# Altium schematic sheet GSM_HTTP_Enabled.SCHDOC: Weather Station with webinterface
size C; Organization: Altium Limited; Address1: L3, 12a Rodborough Rd; Address2: Frenchs Forest; Address3: NSW; Address4: Australia 2086; DocumentNumber: 1; SheetNumber: 1; SheetTotal: 2
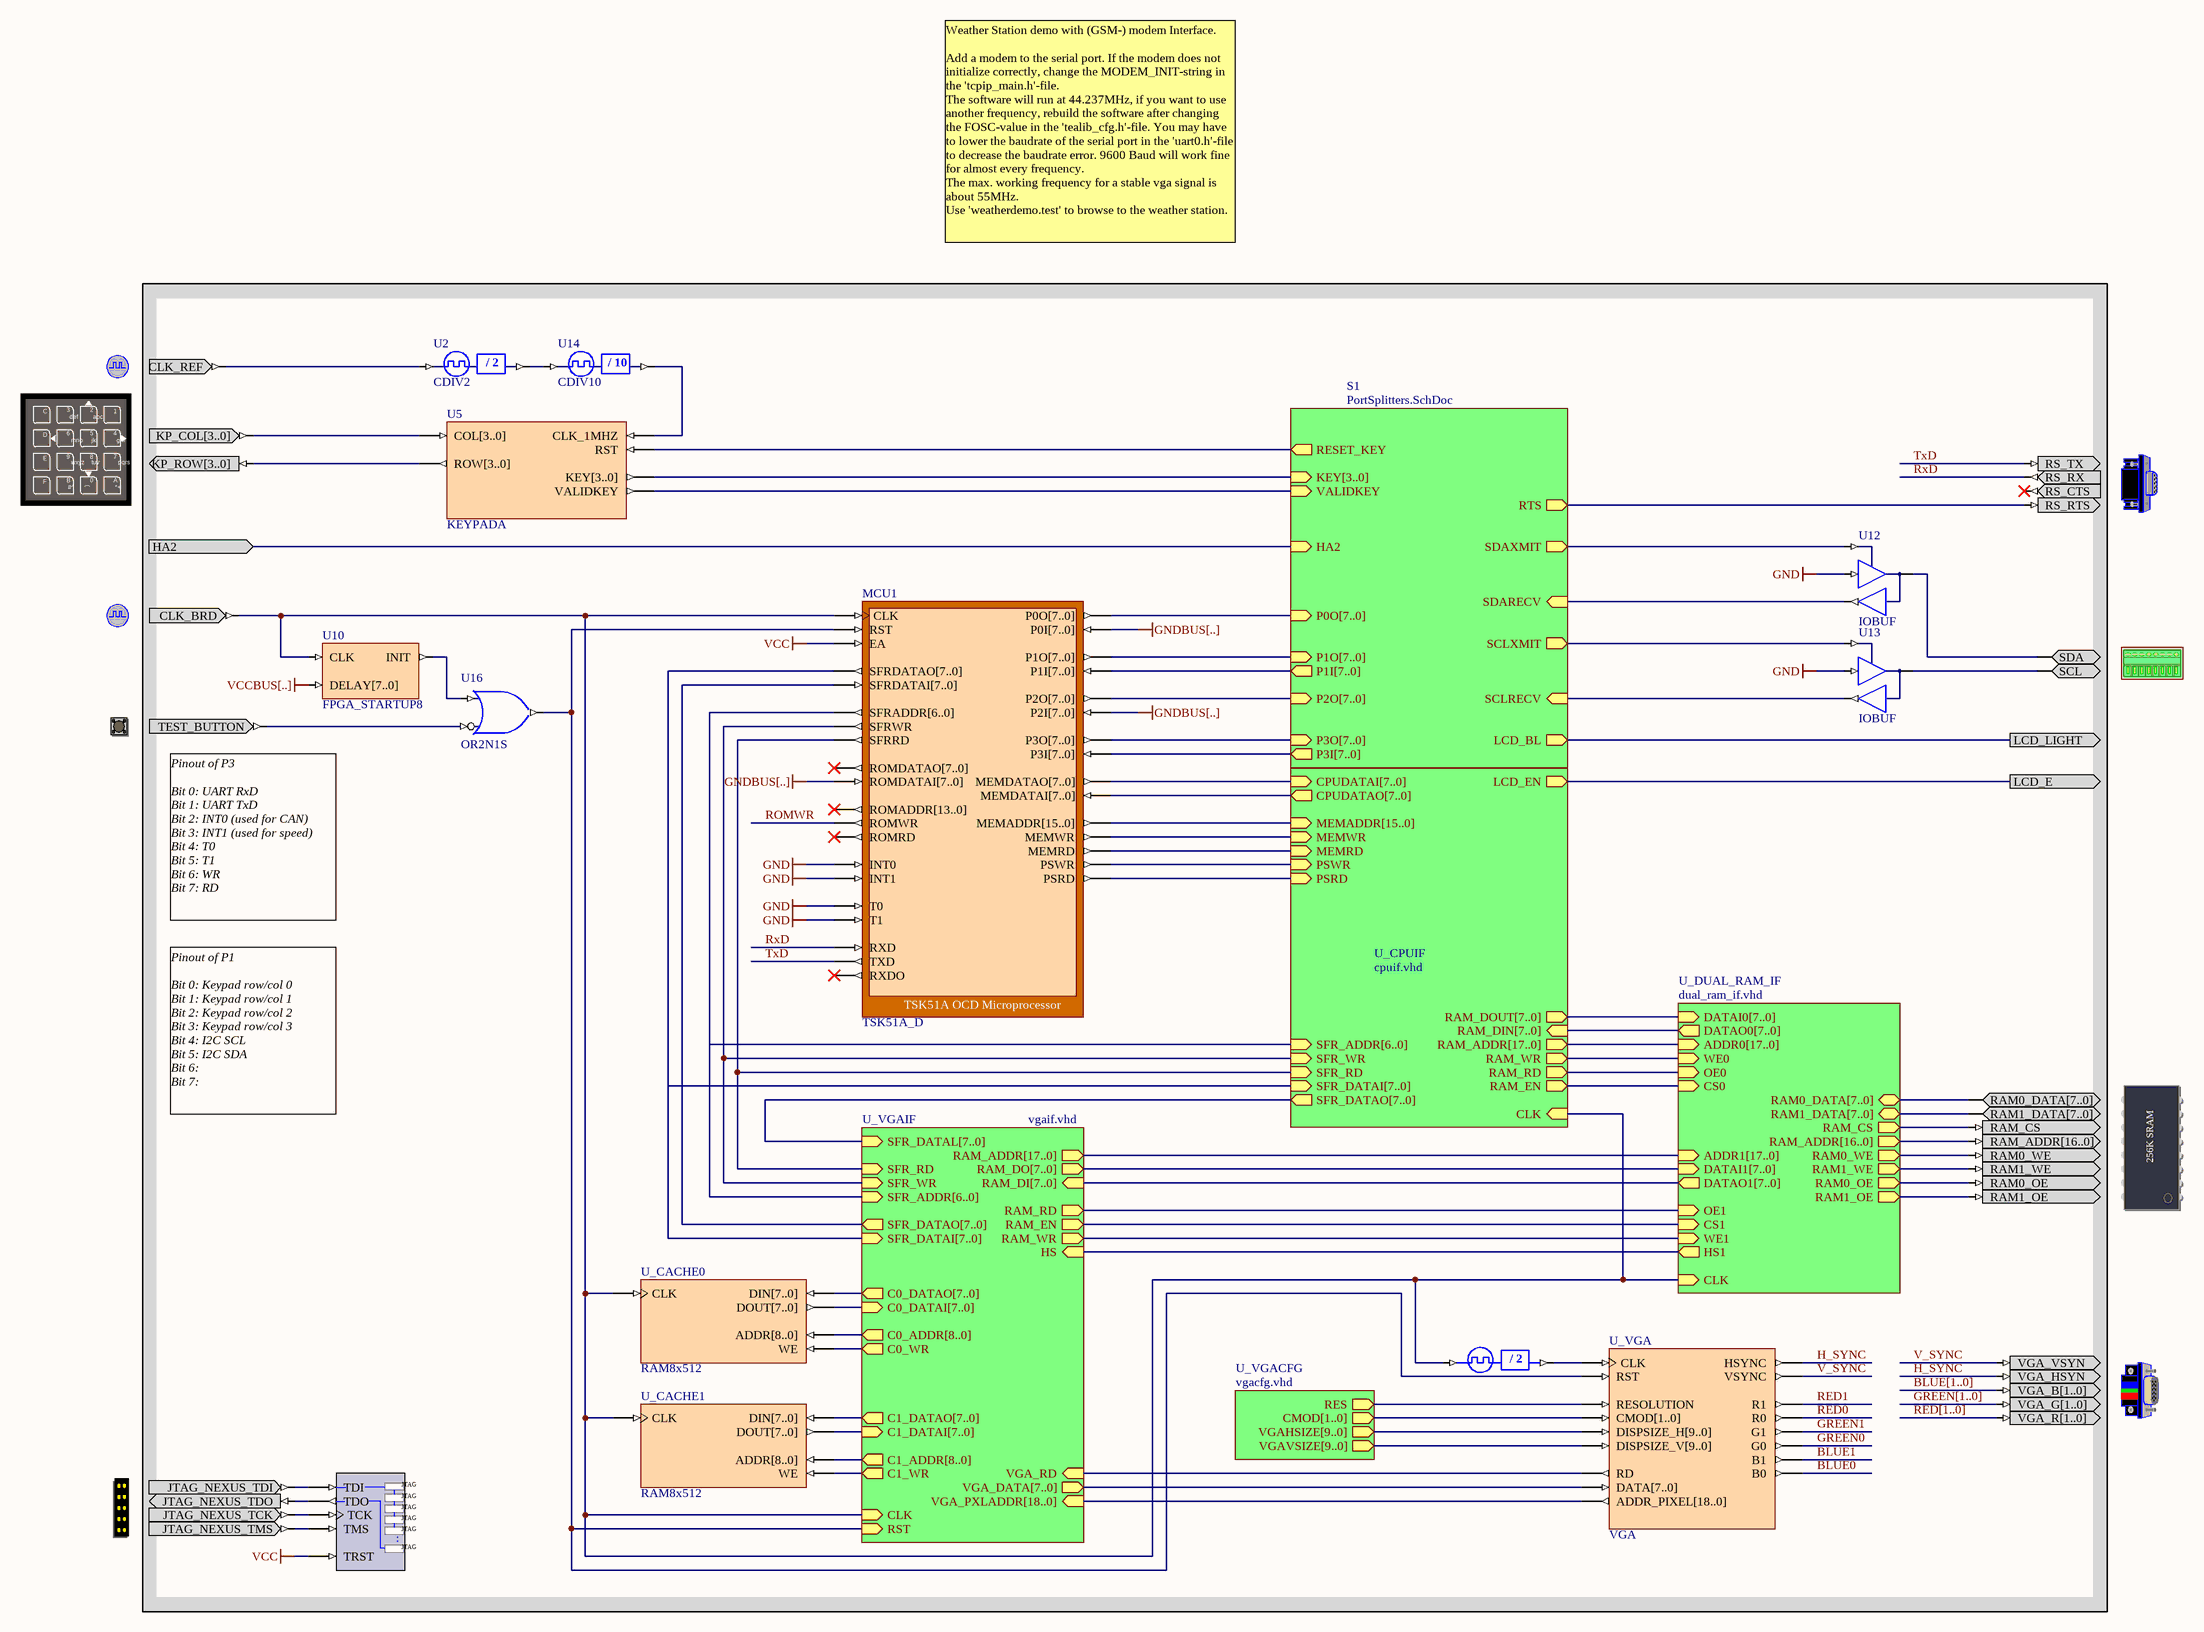
[diagram p0: GSM_HTTP_Enabled.SCHDOC]

## Parts
(Parts that share a designator on the sheet are numbered #1, #2 ... from top to bottom, then left to right.)
?#1  CLOCK_REFERENCE  (value not drawn)
?#2  KEYPAD  (value not drawn)
?#3  RS232CNTR  (value not drawn)
?#4  CLOCK_BOARD  (value not drawn)
?#5  ADCDAC_I2C  (value not drawn)
?#6  TEST_BUTTON  (value not drawn)
?#7  MEMORY256KX8  (value not drawn)
?#8  VGACNTR  (value not drawn)
?#9  NEXUS_JTAG_CONNECTOR  (value not drawn)
MCU1  TSK51A_D
NEXUS_JTAG_PORT  NEXUS_JTAG_PORT  (value not drawn)
U2  CDIV2
U5  KEYPADA
U10  FPGA_STARTUP8
U12  IOBUF
U13  IOBUF
U14  CDIV10
U16  OR2N1S
U_CACHE0  RAM8x512
U_CACHE1  RAM8x512
U_DIV2  CDIV2  (value not drawn)
U_VGA  VGA

## Sub-sheets
S1 = PortSplitters.SchDoc: P0O[7..0] (in), P1O[7..0] (in), P1I[7..0] (out), P2O[7..0] (in), P3O[7..0] (in), P3I[7..0] (out), HA2 (in), SCLXMIT (out), LCD_BL (out), RTS (out), SDAXMIT (out), VALIDKEY (in), KEY[3..0] (in), SCLRECV (in), SDARECV (in), RESET_KEY (out)
U_CPUIF = cpuif.vhd: MEMWR (in), RAM_EN (out), RAM_WR (out), RAM_RD (out), RAM_DOUT[7..0] (out), MEMRD (in), LCD_EN (out), RAM_ADDR[17..0] (out), CLK (in), SFR_ADDR[6..0] (in), SFR_DATAI[7..0] (in), SFR_DATAO[7..0] (out), SFR_WR (in), SFR_RD (in), RAM_DIN[7..0] (in), PSWR (in), PSRD (in), MEMADDR[15..0] (in), CPUDATAI[7..0] (in), CPUDATAO[7..0] (out)
U_DUAL_RAM_IF = dual_ram_if.vhd: DATAI0[7..0] (in), DATAI1[7..0] (in), DATAO0[7..0] (out), DATAO1[7..0] (out), ADDR0[17..0] (in), ADDR1[17..0] (in), WE0 (in), WE1 (in), OE0 (in), OE1 (in), CS0 (in), CS1 (in), HS1 (out), RAM0_DATA[7..0] (bidir), RAM1_DATA[7..0] (bidir), RAM_ADDR[16..0] (out), RAM0_WE (out), RAM1_WE (out), RAM0_OE (out), RAM1_OE (out), RAM_CS (out), CLK (in)
U_VGACFG = vgacfg.vhd: RES (out), CMOD[1..0] (out), VGAHSIZE[9..0] (out), VGAVSIZE[9..0] (out)
U_VGAIF = vgaif.vhd: VGA_PXLADDR[18..0] (in), VGA_DATA[7..0] (out), VGA_RD (in), C1_WR (out), C1_ADDR[8..0] (out), C1_DATAI[7..0] (in), C1_DATAO[7..0] (out), C0_WR (out), C0_ADDR[8..0] (out), C0_DATAI[7..0] (in), C0_DATAO[7..0] (out), RAM_ADDR[17..0] (out), CLK (in), HS (in), RAM_DO[7..0] (out), RAM_RD (out), RAM_EN (out), RAM_WR (out), SFR_ADDR[6..0] (in), SFR_DATAI[7..0] (in), SFR_DATAO[7..0] (out), SFR_WR (in), SFR_RD (in), SFR_DATAL[7..0] (in), RAM_DI[7..0] (in), RST (in)

## Ports
HA2 (in), LCD_E (out), LCD_LIGHT (out)

## Nets
GND: MCU1.INT0 MCU1.INT1 MCU1.T0 MCU1.T1 U12.I U13.I
GNDBUS[..]: MCU1.P0I[7..0] MCU1.P2I[7..0] MCU1.ROMDATAI[7..0]
VCC: MCU1.EA NEXUS_JTAG_PORT.TRST
VCCBUS[..]: U10.DELAY[7..0]
BLUE0: U_VGA.B0
BLUE1: U_VGA.B1
BLUE[1..0]: ?#8.VGA_B[1..0]
GREEN0: U_VGA.G0
GREEN1: U_VGA.G1
GREEN[1..0]: ?#8.VGA_G[1..0]
H_SYNC: ?#8.VGA_HSYN U_VGA.HSYNC
HA2: port HA2, sheet S1/HA2
LCD_E: port LCD_E, sheet U_CPUIF/LCD_EN
LCD_LIGHT: port LCD_LIGHT, sheet S1/LCD_BL
RED0: U_VGA.R0
RED1: U_VGA.R1
RED[1..0]: ?#8.VGA_R[1..0]
ROMWR: MCU1.ROMWR
RxD: ?#3.RS_RX MCU1.RXD
TxD: ?#3.RS_TX MCU1.TXD
V_SYNC: ?#8.VGA_VSYN U_VGA.VSYNC
Net?#1_CLK_REF: ?#1.CLK_REF U2.CLKIN
Net?#2_KP_COL[3..0]: ?#2.KP_COL[3..0] U5.COL[3..0]
Net?#2_KP_ROW[3..0]: ?#2.KP_ROW[3..0] U5.ROW[3..0]
Net?#3_RS_RTS: ?#3.RS_RTS ; sheet S1/RTS
Net?#4_CLK_BRD: ?#4.CLK_BRD MCU1.CLK U10.CLK U_CACHE0.CLK U_CACHE1.CLK U_DIV2.CLKIN ; sheet U_CPUIF/CLK, sheet U_VGAIF/CLK, sheet U_DUAL_RAM_IF/CLK
Net?#5_SCL: ?#5.SCL U13.IO
Net?#5_SDA: ?#5.SDA U12.IO
Net?#6_TEST_BUTTON: ?#6.TEST_BUTTON U16.I0
Net?#7_RAM0_DATA[7..0]: ?#7.RAM0_DATA[7..0] ; sheet U_DUAL_RAM_IF/RAM0_DATA[7..0]
Net?#7_RAM0_OE: ?#7.RAM0_OE ; sheet U_DUAL_RAM_IF/RAM0_OE
Net?#7_RAM0_WE: ?#7.RAM0_WE ; sheet U_DUAL_RAM_IF/RAM0_WE
Net?#7_RAM1_DATA[7..0]: ?#7.RAM1_DATA[7..0] ; sheet U_DUAL_RAM_IF/RAM1_DATA[7..0]
Net?#7_RAM1_OE: ?#7.RAM1_OE ; sheet U_DUAL_RAM_IF/RAM1_OE
Net?#7_RAM1_WE: ?#7.RAM1_WE ; sheet U_DUAL_RAM_IF/RAM1_WE
Net?#7_RAM_ADDR[16..0]: ?#7.RAM_ADDR[16..0] ; sheet U_DUAL_RAM_IF/RAM_ADDR[16..0]
Net?#7_RAM_CS: ?#7.RAM_CS ; sheet U_DUAL_RAM_IF/RAM_CS
Net?#9_JTAG_NEXUS_TCK: ?#9.JTAG_NEXUS_TCK NEXUS_JTAG_PORT.TCK
Net?#9_JTAG_NEXUS_TDI: ?#9.JTAG_NEXUS_TDI NEXUS_JTAG_PORT.TDI
Net?#9_JTAG_NEXUS_TDO: ?#9.JTAG_NEXUS_TDO NEXUS_JTAG_PORT.TDO
Net?#9_JTAG_NEXUS_TMS: ?#9.JTAG_NEXUS_TMS NEXUS_JTAG_PORT.TMS
NetMCU1_MEMADDR[15..0]: MCU1.MEMADDR[15..0] ; sheet U_CPUIF/MEMADDR[15..0]
NetMCU1_MEMDATAI[7..0]: MCU1.MEMDATAI[7..0] ; sheet U_CPUIF/CPUDATAO[7..0]
NetMCU1_MEMDATAO[7..0]: MCU1.MEMDATAO[7..0] ; sheet U_CPUIF/CPUDATAI[7..0]
NetMCU1_MEMRD: MCU1.MEMRD ; sheet U_CPUIF/MEMRD
NetMCU1_MEMWR: MCU1.MEMWR ; sheet U_CPUIF/MEMWR
NetMCU1_P0O[7..0]: MCU1.P0O[7..0] ; sheet S1/P0O[7..0]
NetMCU1_P1I[7..0]: MCU1.P1I[7..0] ; sheet S1/P1I[7..0]
NetMCU1_P1O[7..0]: MCU1.P1O[7..0] ; sheet S1/P1O[7..0]
NetMCU1_P2O[7..0]: MCU1.P2O[7..0] ; sheet S1/P2O[7..0]
NetMCU1_P3I[7..0]: MCU1.P3I[7..0] ; sheet S1/P3I[7..0]
NetMCU1_P3O[7..0]: MCU1.P3O[7..0] ; sheet S1/P3O[7..0]
NetMCU1_PSRD: MCU1.PSRD ; sheet U_CPUIF/PSRD
NetMCU1_PSWR: MCU1.PSWR ; sheet U_CPUIF/PSWR
NetMCU1_RST: MCU1.RST U16.O U_VGA.RST ; sheet U_VGAIF/RST
NetMCU1_SFRADDR[6..0]: MCU1.SFRADDR[6..0] ; sheet U_CPUIF/SFR_ADDR[6..0], sheet U_VGAIF/SFR_ADDR[6..0]
NetMCU1_SFRDATAI[7..0]: MCU1.SFRDATAI[7..0] ; sheet U_VGAIF/SFR_DATAO[7..0]
NetMCU1_SFRDATAO[7..0]: MCU1.SFRDATAO[7..0] ; sheet U_CPUIF/SFR_DATAI[7..0], sheet U_VGAIF/SFR_DATAI[7..0]
NetMCU1_SFRRD: MCU1.SFRRD ; sheet U_CPUIF/SFR_RD, sheet U_VGAIF/SFR_RD
NetMCU1_SFRWR: MCU1.SFRWR ; sheet U_CPUIF/SFR_WR, sheet U_VGAIF/SFR_WR
NetU2_CLKDV: U2.CLKDV U14.CLKIN
NetU5_CLK_1MHZ: U5.CLK_1MHZ U14.CLKDV
NetU5_KEY[3..0]: U5.KEY[3..0] ; sheet S1/KEY[3..0]
NetU5_RST: U5.RST ; sheet S1/RESET_KEY
NetU5_VALIDKEY: U5.VALIDKEY ; sheet S1/VALIDKEY
NetU10_INIT: U10.INIT U16.I1
NetU12_O: U12.O ; sheet S1/SDARECV
NetU12_T: U12.T ; sheet S1/SDAXMIT
NetU13_O: U13.O ; sheet S1/SCLRECV
NetU13_T: U13.T ; sheet S1/SCLXMIT
NetU_CACHE0_ADDR[8..0]: U_CACHE0.ADDR[8..0] ; sheet U_VGAIF/C0_ADDR[8..0]
NetU_CACHE0_DIN[7..0]: U_CACHE0.DIN[7..0] ; sheet U_VGAIF/C0_DATAO[7..0]
NetU_CACHE0_DOUT[7..0]: U_CACHE0.DOUT[7..0] ; sheet U_VGAIF/C0_DATAI[7..0]
NetU_CACHE0_WE: U_CACHE0.WE ; sheet U_VGAIF/C0_WR
NetU_CACHE1_ADDR[8..0]: U_CACHE1.ADDR[8..0] ; sheet U_VGAIF/C1_ADDR[8..0]
NetU_CACHE1_DIN[7..0]: U_CACHE1.DIN[7..0] ; sheet U_VGAIF/C1_DATAO[7..0]
NetU_CACHE1_DOUT[7..0]: U_CACHE1.DOUT[7..0] ; sheet U_VGAIF/C1_DATAI[7..0]
NetU_CACHE1_WE: U_CACHE1.WE ; sheet U_VGAIF/C1_WR
NetU_DIV2_CLKDV: U_DIV2.CLKDV U_VGA.CLK
NetU_VGA_ADDR_PIXEL[18..0]: U_VGA.ADDR_PIXEL[18..0] ; sheet U_VGAIF/VGA_PXLADDR[18..0]
NetU_VGA_CMOD[1..0]: U_VGA.CMOD[1..0] ; sheet U_VGACFG/CMOD[1..0]
NetU_VGA_DATA[7..0]: U_VGA.DATA[7..0] ; sheet U_VGAIF/VGA_DATA[7..0]
NetU_VGA_DISPSIZE_H[9..0]: U_VGA.DISPSIZE_H[9..0] ; sheet U_VGACFG/VGAHSIZE[9..0]
NetU_VGA_DISPSIZE_V[9..0]: U_VGA.DISPSIZE_V[9..0] ; sheet U_VGACFG/VGAVSIZE[9..0]
NetU_VGA_RD: U_VGA.RD ; sheet U_VGAIF/VGA_RD
NetU_VGA_RESOLUTION: U_VGA.RESOLUTION ; sheet U_VGACFG/RES
(unnamed): sheet U_CPUIF/RAM_EN, sheet U_DUAL_RAM_IF/CS0
(unnamed): sheet U_CPUIF/RAM_WR, sheet U_DUAL_RAM_IF/WE0
(unnamed): sheet U_CPUIF/RAM_RD, sheet U_DUAL_RAM_IF/OE0
(unnamed): sheet U_VGAIF/HS, sheet U_DUAL_RAM_IF/HS1
(unnamed): sheet U_VGAIF/RAM_RD, sheet U_DUAL_RAM_IF/OE1
(unnamed): sheet U_VGAIF/RAM_EN, sheet U_DUAL_RAM_IF/CS1
(unnamed): sheet U_VGAIF/RAM_WR, sheet U_DUAL_RAM_IF/WE1

Not connected (* = marked no-connect by the designer): ?#3 RS_CTS*; MCU1 ROMADDR[13..0]* ROMDATAO[7..0]* ROMRD* RXDO*

## Buses and harness runs
bus BLUE[1..0]
bus GREEN[1..0]
bus RED[1..0]
bus sheet U_CPUIF/RAM_ADDR[17..0] = sheet U_DUAL_RAM_IF/ADDR0[17..0]
bus sheet U_CPUIF/RAM_DIN[7..0] = sheet U_DUAL_RAM_IF/DATAO0[7..0]
bus sheet U_CPUIF/RAM_DOUT[7..0] = sheet U_DUAL_RAM_IF/DATAI0[7..0]
bus sheet U_CPUIF/SFR_ADDR[6..0] = sheet U_VGAIF/SFR_ADDR[6..0]
bus sheet U_CPUIF/SFR_DATAI[7..0] = sheet U_VGAIF/SFR_DATAI[7..0]
bus sheet U_CPUIF/SFR_DATAO[7..0] = sheet U_VGAIF/SFR_DATAL[7..0]
bus sheet U_DUAL_RAM_IF/ADDR1[17..0] = sheet U_VGAIF/RAM_ADDR[17..0]
bus sheet U_DUAL_RAM_IF/DATAI1[7..0] = sheet U_VGAIF/RAM_DO[7..0]
bus sheet U_DUAL_RAM_IF/DATAO1[7..0] = sheet U_VGAIF/RAM_DI[7..0]

## Notes on the sheet
- Weather Station demo with (GSM-) modem Interface.
  Add a modem to the serial port. If the modem does not initialize correctly, change the MODEM_INIT-string in the 'tcpip_main.h'-file.
  The software will run at 44.237MHz, if you want to use another frequency, rebuild the software after changing the FOSC-value in the 'tealib_cfg.h'-file. You may have to lower the baudrate of the serial port in the 'uart0.h'-file to decrease the baudrate error. 9600 Baud will work fine for almost every frequency.
  The max. working frequency for a stable vga signal is about 55MHz.
  Use 'weatherdemo.test' to browse to the weather station.
- Pinout of P3
  Bit 0: UART RxD
  Bit 1: UART TxD
  Bit 2: INT0 (used for CAN)
  Bit 3: INT1 (used for speed)
  Bit 4: T0
  Bit 5: T1
  Bit 6: WR
  Bit 7: RD
- Pinout of P1
  Bit 0: Keypad row/col 0
  Bit 1: Keypad row/col 1
  Bit 2: Keypad row/col 2
  Bit 3: Keypad row/col 3
  Bit 4: I2C SCL
  Bit 5: I2C SDA
  Bit 6:
  Bit 7:
- Title
- Size:
- Date:
- File:
- C
- Number:
- Time:
- Revision:
- Sheet
- of
- (in symbol CDIV2) / 2
- (in symbol CDIV10) / 10
- (in symbol KEYPAD) C; 3; 2; 1; def; abc; 6; 5; 4; D; mno; jkl; ghi; E; 9; 8; 7; wxyz; tuv; pqrs; F; B; 0; A; #^; (; *+
- (in symbol MEMORY256KX8) 256K SRAM
- (in symbol NEXUS_JTAG_PORT) JTAG; .

## Library data of the parts
?#1 = CLOCK_REFERENCE: Global System Clock Reference Supply; PortComponent: True; Published: 19-Nov-2003; Publisher: Altium Limited
?#2 = KEYPAD: Key Pad; PortComponent: True; Published: 19-Nov-2003; Publisher: Altium Limited
?#3 = RS232CNTR: DCE Serial Port Connector; PortComponent: True; Published: 19-Nov-2003; Publisher: Altium Limited
?#4 = CLOCK_BOARD: Global System Clock Supply; PortComponent: True; Published: 19-Nov-2003; Publisher: Altium Limited
?#5 = ADCDAC_I2C: Analog Digital/ Digital Analog Converter, I2C Interface; PortComponent: True; Published: 19-Nov-2003; Publisher: Altium Limited
?#6 = TEST_BUTTON: Test Button; PortComponent: True; Published: 19-Nov-2003; Publisher: Altium Limited
?#7 = MEMORY256KX8: SRAM 256kx8; PortComponent: True; Published: 19-Nov-2003; Publisher: Altium Limited
?#8 = VGACNTR: VGA Dsub-15-Female-HD; PortComponent: True; Published: 19-Nov-2003; Publisher: Altium Limited
?#9 = NEXUS_JTAG_CONNECTOR: JTAG Port; PortComponent: True; Published: 19-Nov-2003; Publisher: Altium Limited
MCU1 = TSK51A_D: TSK51A OCD Microprocessor; NEXUS_CORE: Processor_OCDS; NEXUS_JTAG_DEVICE: True; NEXUS_JTAG_ORDER: 0; ChildModel1: RAM256x8_TSK51D; Published: 23/10/2003; Publisher: Altium Hobart Technology Centre; Core Revision: 1.00.00
NEXUS_JTAG_PORT = NEXUS_JTAG_PORT: Nexus Processor JTAG Chain Connector; NEXUS_JTAG_CONNECTOR: True; Published: 18-Nov-2003; Publisher: Altium Limited
U2 U_DIV2 = CDIV2: Clock Divider by 2; ArchiveName: GENERIC
  U2: Published: 18-Nov-2003; Publisher: Altium Limited; Core Revision: 1.00.00
  U_DIV2: Published: 4-Jul-2003; Publisher: Altium Hobart Technology Centre; Class I: Clock Divider
U5 = KEYPADA: Keypad; Published: 2/01/2004; Publisher: Altium Hobart Technology Centre; Core Revision: 1.00.00
U10 = FPGA_STARTUP8: FPGA Startup With 8 Bit Delay; Published: 21/01/2004; Publisher: Altium Hobart Technology Centre; Core Revision: 1.00.00
U12 U13 = IOBUF: Input/Output Buffer; ArchiveName: GENERIC; Published: 9-30-2003; Publisher: Altium Limited; Xilinx Equivalent: IOBUF; Core Revision: 1.00.00
U14 = CDIV10: Clock Divider by 10; ArchiveName: GENERIC; Published: 18-Dec-2003; Publisher: Altium Limited; Core Revision: 1.00.00
U16 = OR2N1S: 2-Input OR Gate with Active Low A Input, Single Pin Version; Xilinx Equivalent: OR2B1; ArchiveName: GENERIC; Published: 18-Dec-2003; Publisher: Altium Limited; Core Revision: 1.00.00
U_CACHE0 U_CACHE1 = RAM8x512: Single Port Random Access Memory 512 x 8; Memory_Depth: 512; Memory_Type: RAM_SinglePortBlock; Memory_Width: 8; Memory_ClockEdge: Rising; Nexus_Core: Memory_Program; Published: 26/09/2003; Publisher: Altium Hobart Technology Center
U_VGA = VGA: VGA Controller; Published: 21/10/2003; Publisher: Altium Hobart Technology Centre; Core Revision: 1.00.00